# Altium schematic sheet MSXIV_BatteryModuleConnectorBoard.SchDoc
size Letter
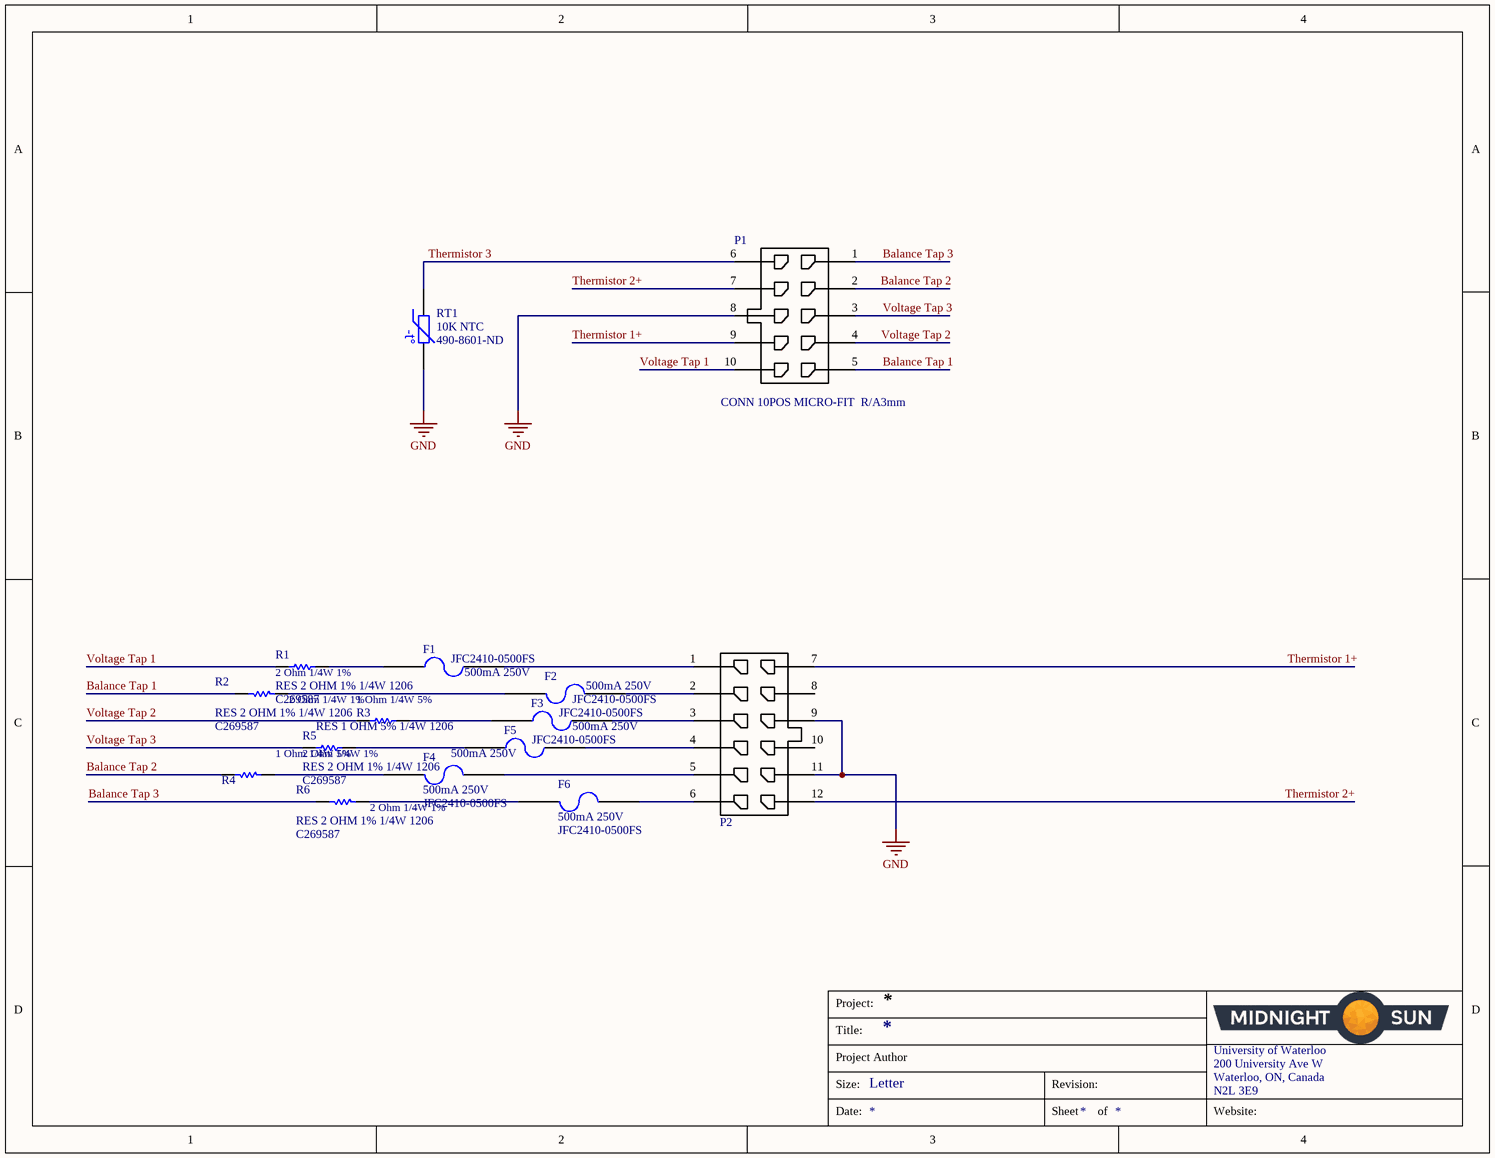
[diagram p0: MSXIV_BatteryModuleConnectorBoard.SchDoc]

## Parts
F1  500mA 250V  Manufacturer Part Number 1: JFC2410-0500FS  [FUSE JFC2410-0500FS]
F2  500mA 250V  Manufacturer Part Number 1: JFC2410-0500FS  [FUSE JFC2410-0500FS]
F3  500mA 250V  Manufacturer Part Number 1: JFC2410-0500FS  [FUSE JFC2410-0500FS]
F4  500mA 250V  Manufacturer Part Number 1: JFC2410-0500FS  [FUSE JFC2410-0500FS]
F5  500mA 250V  Manufacturer Part Number 1: JFC2410-0500FS  [FUSE JFC2410-0500FS]
F6  500mA 250V  Manufacturer Part Number 1: JFC2410-0500FS  [FUSE JFC2410-0500FS]
P1  CONN 10POS MICRO-FIT  R/A3mm  [CONN, 10POS R/A Microfit]
P2  CONN 12POS HEADER R/A MICROFIT 3MM  [CONN, 12POS R/A Microfit]  (value not drawn)
R1  RES 2 OHM 1% 1/4W 1206  Supplier Part Number 1: C269587  [RES 1206]
R2  RES 2 OHM 1% 1/4W 1206  Supplier Part Number 1: C269587  [RES 1206]
R3  RES 1 OHM 5% 1/4W 1206  [RES 1206]
R4  RES 1 OHM 5% 1/4W 1206  [RES 1206]  (value not drawn)
R5  RES 2 OHM 1% 1/4W 1206  Supplier Part Number 1: C269587  [RES 1206]
R6  RES 2 OHM 1% 1/4W 1206  Supplier Part Number 1: C269587  [RES 1206]
RT1  10K NTC  Supplier Part Number 1: 490-8601-ND  [NTC THERMISTOR BEAD]

## Nets
GND: P1.8 P2.9 P2.11 RT1.2
Balance Tap 1: P1.5 R2.2
Balance Tap 2: P1.2 R4.2
Balance Tap 3: P1.1 R6.2
Thermistor 1+: P1.9 P2.7
Thermistor 2+: P1.7 P2.12
Thermistor 3: P1.6 RT1.1
Voltage Tap 1: P1.10 R1.1
Voltage Tap 2: P1.4 R3.1
Voltage Tap 3: P1.3 R5.1
NetF1_1: F1.1 R1.2
NetF1_2: F1.2 P2.1
NetF2_1: F2.1 P2.2
NetF2_2: F2.2 R2.1
NetF3_1: F3.1 R3.2
NetF3_2: F3.2 P2.3
NetF4_1: F4.1 P2.5
NetF4_2: F4.2 R4.1
NetF5_1: F5.1 R5.2
NetF5_2: F5.2 P2.4
NetF6_1: F6.1 P2.6
NetF6_2: F6.2 R6.1

Not connected (* = marked no-connect by the designer): P2 8 10

## Notes on the sheet
- Project:
- Title:
- Size:
- Project Author
- Letter
- Revision:
- University of Waterloo
- 200 University Ave W
- Waterloo, ON, Canada
- N2L 3E9
- Date:
- Sheet
- of
- Website:
- (in symbol NTC THERMISTOR 10K 1% BEAD) -t°
- (in symbol RES 1 OHM 5% 1/4W 1206) 1 Ohm 1/4W 5%
- (in symbol RES 2 OHM 1% 1/4W 1206) 2 Ohm 1/4W 1%

## Library data of the parts
F1-F6 = FUSE 500MA LCSC: 2410 Surface Mount Fuses RoHS; Manufacturer 1: Shenzen JDT Fuse; ComponentLink1Description: Shenzhen JDT Fuse; ComponentLink1URL: https://datasheet.lcsc.com/szlcsc/1809211424_Shenzhen-JDT-Fuse-JFC2410-0500FS_C136360.pdf; Supplier 1: LCSC; Supplier Part Number 1: C136360; Pricing 1: 1=0.0591USD
P1 = CONN 10POS MICRO-FIT  R/A3mm: CONN HEADER R/A 10POS 3MM; Manufacturer 1: Molex; Manufacturer Part Number 1: 0430451000; Connector Type: Male Pin; Number of Positions: 10; Contact Resistance: 10mR; Max Voltage Rating (AC): 250V; Row Spacing: 0.118inch; Supplier 1: Digi-Key; Supplier Part Number 1: WM1817-ND; Packaging: Tray; Number of Rows: 2; Termination: Solder; Fastening Type: Ramp; Contact Material: Brass; ComponentLink1URL: https://datasheet.ciiva.com/6814/430450202-sd-6814012.pdf?src-supplier=Digi-Key; ComponentLink1Description: https://datasheet.ciiva.com/6814/430450202-sd-6814012.pdf?src-supplier=Digi-Key; RoHS: Yes; Category: Headers and Wire Housings; Stock 1: 2003; Pricing 1: 1=2.57000, 10=2.33100, 100=1.99790, 500=1.66496, 1000=1.42710, 5000=1.26536 (USD); Mount: Through Hole; Color: Black; Contact Plating: Tin; Housing Color: Black; Housing Material: Polymer; Min Operating Temperature: -40°C; Max Operating Temperature: 105°C; Number of Contacts: 10; Orientation: Right Angle; Length: 19.15mm; Pitch: 3mm; Depth: 12.2mm; Flammability Rating: UL94 V-0
P2 = CONN 12POS HEADER R/A 3MM: Conn Power HDR 12 POS 3mm Solder RA Thru-Hole 12 Terminal 1 Port Micro-Fit 3.0™ Tray; Manufacturer 1: Molex; Manufacturer Part Number 1: 0430451200; Connector Type: Male Pin; Number of Positions: 12; Contact Resistance: 10mR; Max Voltage Rating (AC): 250V; Row Spacing: 0.118inch; Supplier 1: Digi-Key; RoHS: Yes; Category: Headers and Wire Housings; Stock 1: 5742; Pricing 1: 1=2.73000, 10=2.62200, 100=2.18500, 500=1.85726, 1000=1.58413, 5000=1.42025 (USD); Packaging: Tray; Number of Rows: 2; Termination: Solder; Fastening Type: Ramp; Contact Material: Brass; ComponentLink1URL: https://datasheet.ciiva.com/6814/430450202-sd-6814012.pdf?src-supplier=Digi-Key; ComponentLink1Description: https://datasheet.ciiva.com/6814/430450202-sd-6814012.pdf?src-supplier=Digi-Key; Supplier Part Number 1: WM1818-ND; Mount: Through Hole; Contact Plating: Tin; Color: Black; Housing Color: Black; Housing Material: Polymer; Min Operating Temperature: -40°C; Max Operating Temperature: 105°C; Number of Contacts: 12; Orientation: Right Angle; Length: 22.15mm; Pitch: 3mm; Depth: 12.2mm; Flammability Rating: UL94 V-0
R1 R2 R5 R6 = RES 2 OHM 1% 1/4W 1206: 2 ±1% 1/4W 1206 Chip Resistor - Surface Mount RoHS /; Manufacturer 1: TyoHM; Manufacturer Part Number 1: RMC120621%N; Power Rating: 250mW; Resistance: 2R; Voltage Rating (DC): 200V; Supplier 1: LCSC; RoHS: No; Category: Chip SMD Resistors; Case/Package: 1206; Lead Free: Lead Free
R3 R4 = RES 1 OHM 5% 1/4W 1206: 1 ±5% 1/4W 1206 Chip Resistor - Surface Mount RoHS /; Manufacturer 1: TyoHM; Manufacturer Part Number 1: RMC120615%N; Supplier 1: LCSC; Supplier Part Number 1: C325901
RT1 = NTC THERMISTOR 10K 1% BEAD: NTC Thermistor 10k Bead; Manufacturer: Murata Electronics North America; Manufacturer Part Number: NXRT15XH103FA1B030; Resistance Tolerance: ±1%; B25/50: 3380K; B25/85: 3434K; B25/100: 3455K; Supplier 1: Digi-Key; RoHS: RoHS Compliant; Category: Sensors, Transducers; Stock 1: 25017; Pricing 1: 1=0.96, 5=0.91, 10=0.792, 25=0.696, 50=0.5784, 100=0.4925, 500=0.42834, 1000=0.3748, 5000=0.33197 (CAD); Packaging: Bulk; Part Status: Active; Resistance in Ohms @ 25°C: 10k; B Value Tolerance: ±1%; B0/50: -; B25/75: -; Operating Temperature: -40°C ~ 125°C; Length - Lead Wire: -; Mounting Type: Through Hole; Package / Case: Bead; ComponentLink1URL: https://www.murata.com/~/media/webrenewal/support/library/catalog/products/thermistor/ntc/r44e.ashx; ComponentLink1Description: https://www.murata.com/~/media/webrenewal/support/library/catalog/products/thermistor/ntc/r44e.ashx